# Altium project UVB LED Controller.PrjPcb
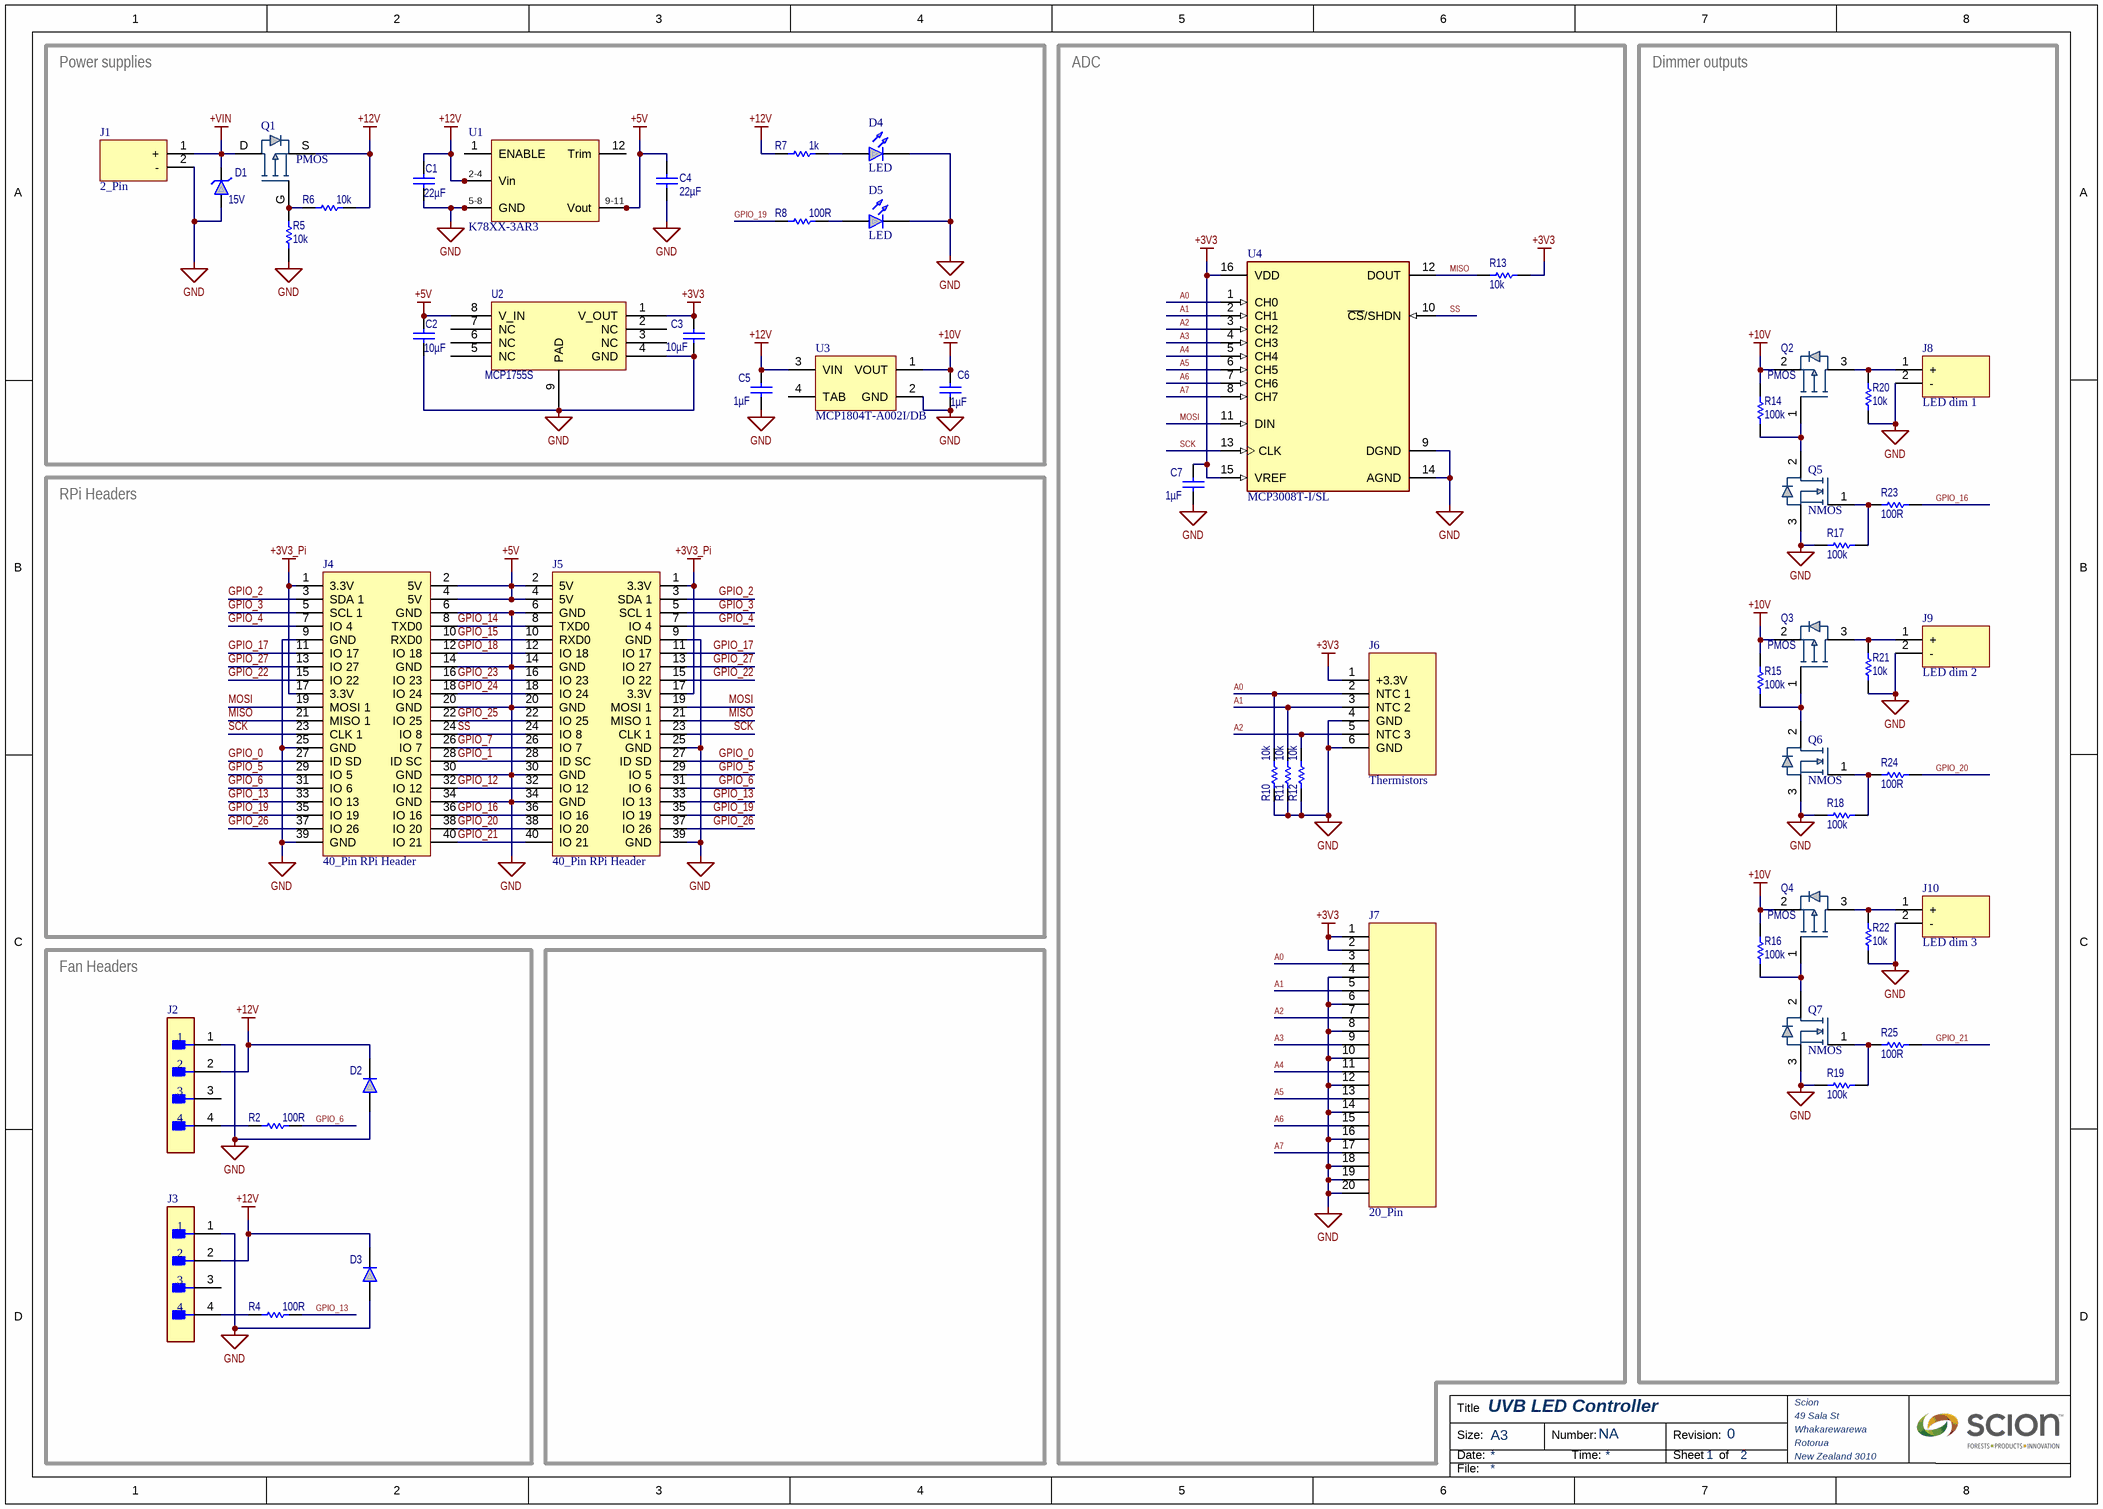
[diagram p0: UVB LED Controller.SchDoc]
2 sheets, 142 parts. Net scope: global (net labels, ports and power ports of the same name join across sheets).
Board file: UVB LED Controller.PcbDoc
Sheets:
  UVB LED Controller.SchDoc
  UVB LED Controller - current balancing.SchDoc

## Sheet UVB LED Controller.SchDoc: UVB LED Controller
size A3; Author: Peake J; CompanyName: Scion Research; DrawnBy: Peake J; Engineer: Peake J; Organization: Scion; Address1: 49 Sala St; Address2: Whakarewarewa; Address3: Rotorua; Address4: New Zealand 3010; DocumentNumber: NA; Revision: 0; SheetNumber: 1; SheetTotal: 2

### Parts
C1  value 22µF  [1206_CAP]  (hidden comment: Capacitor)
C2  value 10µF  [0603_CAP]  (hidden comment: Capacitor)
C3  value 10µF  [0603_CAP]  (hidden comment: Capacitor)
C4  value 22µF  [1206_CAP]  (hidden comment: Capacitor)
C5  value 1µF  [0603_CAP]  (hidden comment: Capacitor)
C6  value 1µF  [0603_CAP]  (hidden comment: Capacitor)
C7  value 1µF  [0603_CAP]  (hidden comment: Capacitor)
D1  Rated Voltage: 15V  [SMBJ]  (hidden comment: Transil)
D2  Diode  [SOD-123]  (value not drawn)
D3  Diode  [SOD-123]  (value not drawn)
D4  LED  [KPA-2106S_LED]
D5  LED  [KPA-2106S_LED]
J1  2_Pin  [2P 3.81mm Header Plugable]
J2  22-29-2041  [FP-22-29-2041-MFG]  (value not drawn)
J3  22-29-2041  [FP-22-29-2041-MFG]  (value not drawn)
J4  40_Pin RPi Header  [40_Pin_0.1in_male_header]
J5  40_Pin RPi Header  [40_Pin_0.1in_female_header]
J6  Thermistors  [6P RA MOLEX Clik-MATE 1.5mm]
J7  20_Pin  [20P 2.54mm DIP header]
J8  LED dim 1  [2P 3.81mm Header Plugable]
J9  LED dim 2  [2P 3.81mm Header Plugable]
J10  LED dim 3  [2P 3.81mm Header Plugable]
Q1  PMOS  [PowerDI 5060-8]
Q2  PMOS  [SOT-23-PMOS]
Q3  PMOS  [SOT-23-PMOS]
Q4  PMOS  [SOT-23-PMOS]
Q5  NMOS  [SOT-23]
Q6  NMOS  [SOT-23]
Q7  NMOS  [SOT-23]
R2  value 100R  [0603_RES]  (hidden comment: Resistor)
R4  value 100R  [0603_RES]  (hidden comment: Resistor)
R5  value 10k  [0603_RES]  (hidden comment: Resistor)
R6  value 10k  [0603_RES]  (hidden comment: Resistor)
R7  value 1k  [0603_RES]  (hidden comment: Resistor)
R8  value 100R  [0603_RES]  (hidden comment: Resistor)
R10  value 10k  [0603_RES]  (hidden comment: Resistor)
R11  value 10k  [0603_RES]  (hidden comment: Resistor)
R12  value 10k  [0603_RES]  (hidden comment: Resistor)
R13  value 10k  [0603_RES]  (hidden comment: Resistor)
R14  value 100k  [0603_RES]  (hidden comment: Resistor)
R15  value 100k  [0603_RES]  (hidden comment: Resistor)
R16  value 100k  [0603_RES]  (hidden comment: Resistor)
R17  value 100k  [0603_RES]  (hidden comment: Resistor)
R18  value 100k  [0603_RES]  (hidden comment: Resistor)
R19  value 100k  [0603_RES]  (hidden comment: Resistor)
R20  value 10k  [0603_RES]  (hidden comment: Resistor)
R21  value 10k  [0603_RES]  (hidden comment: Resistor)
R22  value 10k  [0603_RES]  (hidden comment: Resistor)
R23  value 100R  [0603_RES]  (hidden comment: Resistor)
R24  value 100R  [0603_RES]  (hidden comment: Resistor)
R25  value 100R  [0603_RES]  (hidden comment: Resistor)
U1  K78XX-3AR3  [K78XX-3AR3-Footprint]
U2  MCP1755S  [8P 2x3 DFN]
U3  MCP1804T-A002I/DB  [SOT-223-DB3_N]
U4  MCP3008T-I/SL  [FP-C04-108-MFG]

### Blocks framed on the sheet
Power supplies: C1-C6 D1 D4 D5 J1 Q1 R5-R8 U1-U3
ADC: C7 J6 J7 R10-R13 U4
Dimmer outputs: J8-J10 Q2-Q7 R14-R25
RPi Headers: J4 J5
Fan Headers: D2 D3 J2 J3 R2 R4

### Nets
+3V3: C3.1 C7.1 J6.1(+3.3V) J7.1 J7.2 R13.1 U2.1(V_OUT) U4.15(VREF) U4.16(VDD)
+3V3_Pi: J4.1(3.3V) J4.17(3.3V) J5.1(3.3V) J5.17(3.3V)
+5V: C2.1 C4.2 J4.2(5V) J4.4(5V) J5.2(5V) J5.4(5V) U1.9(Vout) U1.10(Vout) U1.11(Vout) U2.8(V_IN)
+10V: C6.1 Q2.2(S) Q3.2(S) Q4.2(S) R14.2 R15.2 R16.2 U3.1(VOUT)
+12V: C1.1 C5.1 D2.1(K) D3.1(K) J2.2 J3.2 Q1.S R6.2 R7.1 U1.2(Vin) U1.3(Vin) U1.4(Vin) U3.3(VIN)
+VIN: D1.2(K) J1.1(+) Q1.D
GND: C1.2 C2.2 C3.2 C4.1 C5.2 C6.2 C7.2 D1.1(A) D2.2(A) D3.2(A) D4.1(K) D5.1(K) J1.2(-) J2.1 J3.1 J4.6(GND) J4.9(GND) J4.14(GND) J4.20(GND) J4.25(GND) J4.30(GND) J4.34(GND) J4.39(GND) J5.6(GND) J5.9(GND) J5.14(GND) J5.20(GND) J5.25(GND) J5.30(GND) J5.34(GND) J5.39(GND) J6.4(GND) J6.6(GND) J7.4 J7.6 J7.8 J7.10 J7.12 J7.14 J7.16 J7.18 J7.19 J7.20 J8.2(-) J9.2(-) J10.2(-) Q5.3(S) Q6.3(S) Q7.3(S) R5.1 R10.1 R11.1 R12.1 R17.2 R18.2 R19.2 R20.1 R21.1 R22.1 U1.5(GND) U1.6(GND) U1.7(GND) U1.8(GND) U2.4(GND) U2.9(PAD) U3.2(GND) U4.9(DGND) U4.14(AGND)
A0: J6.2(NTC_1) J7.3 R10.2 U4.1(CH0)
A1: J6.3(NTC_2) J7.5 R11.2 U4.2(CH1)
A2: J6.5(NTC_3) J7.7 R12.2 U4.3(CH2)
A3: J7.9 U4.4(CH3)
A4: J7.11 U4.5(CH4)
A5: J7.13 U4.6(CH5)
A6: J7.15 U4.7(CH6)
A7: J7.17 U4.8(CH7)
GPIO_0: J4.27(ID_SD) J5.27(ID_SD)
GPIO_1: J4.28(ID_SC) J5.28(ID_SC)
GPIO_2: J4.3(SDA_1) J5.3(SDA_1)
GPIO_3: J4.5(SCL_1) J5.5(SCL_1)
GPIO_4: J4.7(IO_4) J5.7(IO_4)
GPIO_5: J4.29(IO_5) J5.29(IO_5)
GPIO_6: J4.31(IO_6) J5.31(IO_6) R2.2
GPIO_7: J4.26(IO_7) J5.26(IO_7)
GPIO_12: J4.32(IO_12) J5.32(IO_12)
GPIO_13: J4.33(IO_13) J5.33(IO_13) R4.2
GPIO_14: J4.8(TXD0) J5.8(TXD0)
GPIO_15: J4.10(RXD0) J5.10(RXD0)
GPIO_16: J4.36(IO_16) J5.36(IO_16) R23.1
GPIO_17: J4.11(IO_17) J5.11(IO_17)
GPIO_18: J4.12(IO_18) J5.12(IO_18)
GPIO_19: J4.35(IO_19) J5.35(IO_19) R8.1
GPIO_20: J4.38(IO_20) J5.38(IO_20) R24.1
GPIO_21: J4.40(IO_21) J5.40(IO_21) R25.1
GPIO_22: J4.15(IO_22) J5.15(IO_22)
GPIO_23: J4.16(IO_23) J5.16(IO_23)
GPIO_24: J4.18(IO_24) J5.18(IO_24)
GPIO_25: J4.22(IO_25) J5.22(IO_25)
GPIO_26: J4.37(IO_26) J5.37(IO_26)
GPIO_27: J4.13(IO_27) J5.13(IO_27)
MISO: J4.21(MISO_1) J5.21(MISO_1) R13.2 U4.12(DOUT)
MOSI: J4.19(MOSI_1) J5.19(MOSI_1) U4.11(DIN)
SCK: J4.23(CLK_1) J5.23(CLK_1) U4.13(CLK)
SS: J4.24(IO_8) J5.24(IO_8) U4.10(~{CS}/SHDN)
NetD4_2: D4.2(A) R7.2
NetD5_2: D5.2(A) R8.2
NetJ2_4: J2.4 R2.1
NetJ3_4: J3.4 R4.1
NetJ8_1: J8.1(+) Q2.3(D) R20.2
NetJ9_1: J9.1(+) Q3.3(D) R21.2
NetJ10_1: J10.1(+) Q4.3(D) R22.2
NetQ1_G: Q1.G R5.2 R6.1
NetQ2_1: Q2.1(G) Q5.2(D) R14.1
NetQ3_1: Q3.1(G) Q6.2(D) R15.1
NetQ4_1: Q4.1(G) Q7.2(D) R16.1
NetQ5_1: Q5.1(G) R17.1 R23.2
NetQ6_1: Q6.1(G) R18.1 R24.2
NetQ7_1: Q7.1(G) R19.1 R25.2

Not connected (* = marked no-connect by the designer): J2 3; J3 3; U1 1(ENABLE) 12(Trim); U2 2(NC) 3(NC) 5(NC) 6(NC) 7(NC); U3 4(TAB)

### Notes on the sheet
- Title
- Size:
- Date:
- A3
- Number:
- Time:
- Revision:
- Sheet
- of
- File:
- (in symbol CMP-015-000000-2) 2-4; 5-8; 9-11

### Library data of the parts
C1-C7 = CMP-001-00172-2: SMD Capacitor; Pins: 2; Source: Discrete.SchLib; Design Item ID: Capacitor; Component Type: Standard
D1 = CMP-079-000108-2: Transient Voltage Suppressor; MFN: SMBJ33A; Component Type: Standard; Pin Count: 2; Source: Discrete.SchLib; Breakdown Voltage: *; Design Item ID: Transil; Clamping Voltage: *
D2 D3 = CMP-004-00083-4: SMD Diode; Design Item ID: Diode; Pins: 2; Source: Discrete.SchLib; Component Type: Standard; Pin Count: 2
D4 D5 = CMP-004-00084-2: SMD LED; Colour: RED; Source: Discrete.SchLib; Design Item ID: LED; Component Type: Standard; Pin Count: 2; Pins: 2
J1 J8-J10 = CMP-002-00173-1: 2 Pin Connector; Design Item ID: 2_Pin; Pins: 2; Pin Count: 2; MFN: *; Component Type: Standard; Source: Connectors.SchLib
J2 J3 = CMP-04776-000366-1: CONN HEADER VERT 4POS 2.54MM; Insulation Resistance: 50GR; Voltage Rating: 250V; Glow Wire Compliant: Non-compliant; Max Current Rating: 4A; Number of Circuits: 4; Contact Resistance: 10mR; Gender: Male; Number of Lines: 1; Length: 10.16mm; Radiation Hardening: No; Pitch: 2.54mm; Contact Material: Brass; Height: 11.7mm; Max Operating Temperature: 75°C; Flammability Rating: UL94 V-0; Mount: Through Hole; Voltage Rating (DC): 250V; Halogen Free: Low Halogen; Housing Color: White; Package Quantity: 1500; Series: KK® 6410; Number of Rows: 1; Housing Material: Nylon; Depth: 5.8mm; RoHS Compliant: Yes; Orientation: Straight; Contact Gender: Male; Color: Natural; Current Rating: 4A; Contact Mating Length: 0.295inch; Number of Poles: 4; Packaging: Bulk; Contact Type: Male Pin; Termination: Solder; Number of Positions: 4; Number of Contacts: 4; Lead Free: Lead Free; Min Operating Temperature: 0°C; Fastening Type: Friction; Contact Plating: Gold
J4 J5 = CMP-002-00133-3: 40 pin header for Raspberry Pi compatible connections; Source: All Components - 30.06.23 - 18.27.SchLib; Component Type: Standard; Pin Count: 40; Design Item ID: CMP-00031-2
J6 = CMP-002-00180-3: 6 Pin Connector; Pins: 6; Component Type: Standard; Pin Count: 6; Design Item ID: 6_Pin; Source: Connectors.SchLib
J7 = CMP-002-00001-3: 20 pin connector
Q1 = CMP-079-000102-2: P Channel MOSFET; MFN: *; Design Item ID: PMOS GDS; VGS Max: *; Continuous Current: *; VDS Breakdown: *; Source: P-MOS.SchLib; Component Type: Standard; Pin Count: 3
Q2-Q4 = CMP-079-000100-1: P Channel MOSFET; MFN: BSS308PE; Source: P-MOS.SchLib; Component Type: Standard; Design Item ID: PMOS; Pin Count: 3
Q5-Q7 = CMP-079-000093-2: N Channel MOSFET; Design Item ID: NMOS; Source: N-MOS.SchLib; MFN: *; Pin Count: 3; Component Type: Standard
R2 R4-R8 R10-R25 = CMP-009-00356-1: SMD Resistor; Pins: 2; Source: Discrete.SchLib; Component Type: Standard; Design Item ID: Resistor
U1 = CMP-015-000000-2: Mornsun DC-DC power module 3A, 0-36Vin, 3.3-15V out
U2 = CMP-079-000090-2: LDO Linear Voltage Regulator; Pin Count: 9; Component Type: Standard; Source: Microchip.SchLib; Design Item ID: MCP1755S
U3 = CMP-0136-00501-1: 150 mA, 28V LDO Regulator With Shutdown, 3-Pin SOT-223, Industrial Temperature, Tape and Reel; PackageDescription: 3-Lead Plastic Small Outline Transistor (DB) [SOT-223]; PackageReference: SOT-223-DB3; DatasheetVersion: revB, Nov-2009; PackageVersion: revBB, Aug-2009
U4 = CMP-0188-00351-3: IC ADC 10BIT SAR 16SOIC; Resolution: 10b; Output Voltage: 4.1V; Number of Channels: 8; Number of Elements: 1; Number of Bits: 10; Full Scale Error: 1LSB; Signal to Noise Ratio (SNR): 200dB; Interface: SPI; Nominal Supply Current: 425uA; Sampling Rate: 200KS/s; Supply Type: Single; Min Supply Voltage: 2.7V; Max Supply Voltage: 5.5V; Operating Supply Voltage: 5V; Polarity: Unipolar; Min Operating Temperature: -40°C; REACH SVHC: No SVHC; Integral Nonlinearity (INL): 1LSB; Mount: Surface Mount; Number of Converters: 1; Differential Nonlinearity: 1LSB; Contact Plating: Tin; Lead Free: Lead Free; Conversion Rate: 200KS/s; Radiation Hardening: No; Max Operating Temperature: 85°C; Case/Package: SOIC; Package Quantity: 2600; Number of Pins: 16; Packaging: Tape and Reel; Number of A/D Converters: 1

## Sheet UVB LED Controller - current balancing.SchDoc: UVB LED Current Balancing
size A3; Author: Peake J; CompanyName: Scion Research; DrawnBy: Peake J; Engineer: Peake J; Organization: Scion; Address1: 49 Sala St; Address2: Whakarewarewa; Address3: Rotorua; Address4: New Zealand 3010; DocumentNumber: NA; Revision: 0; SheetNumber: 2; SheetTotal: 2
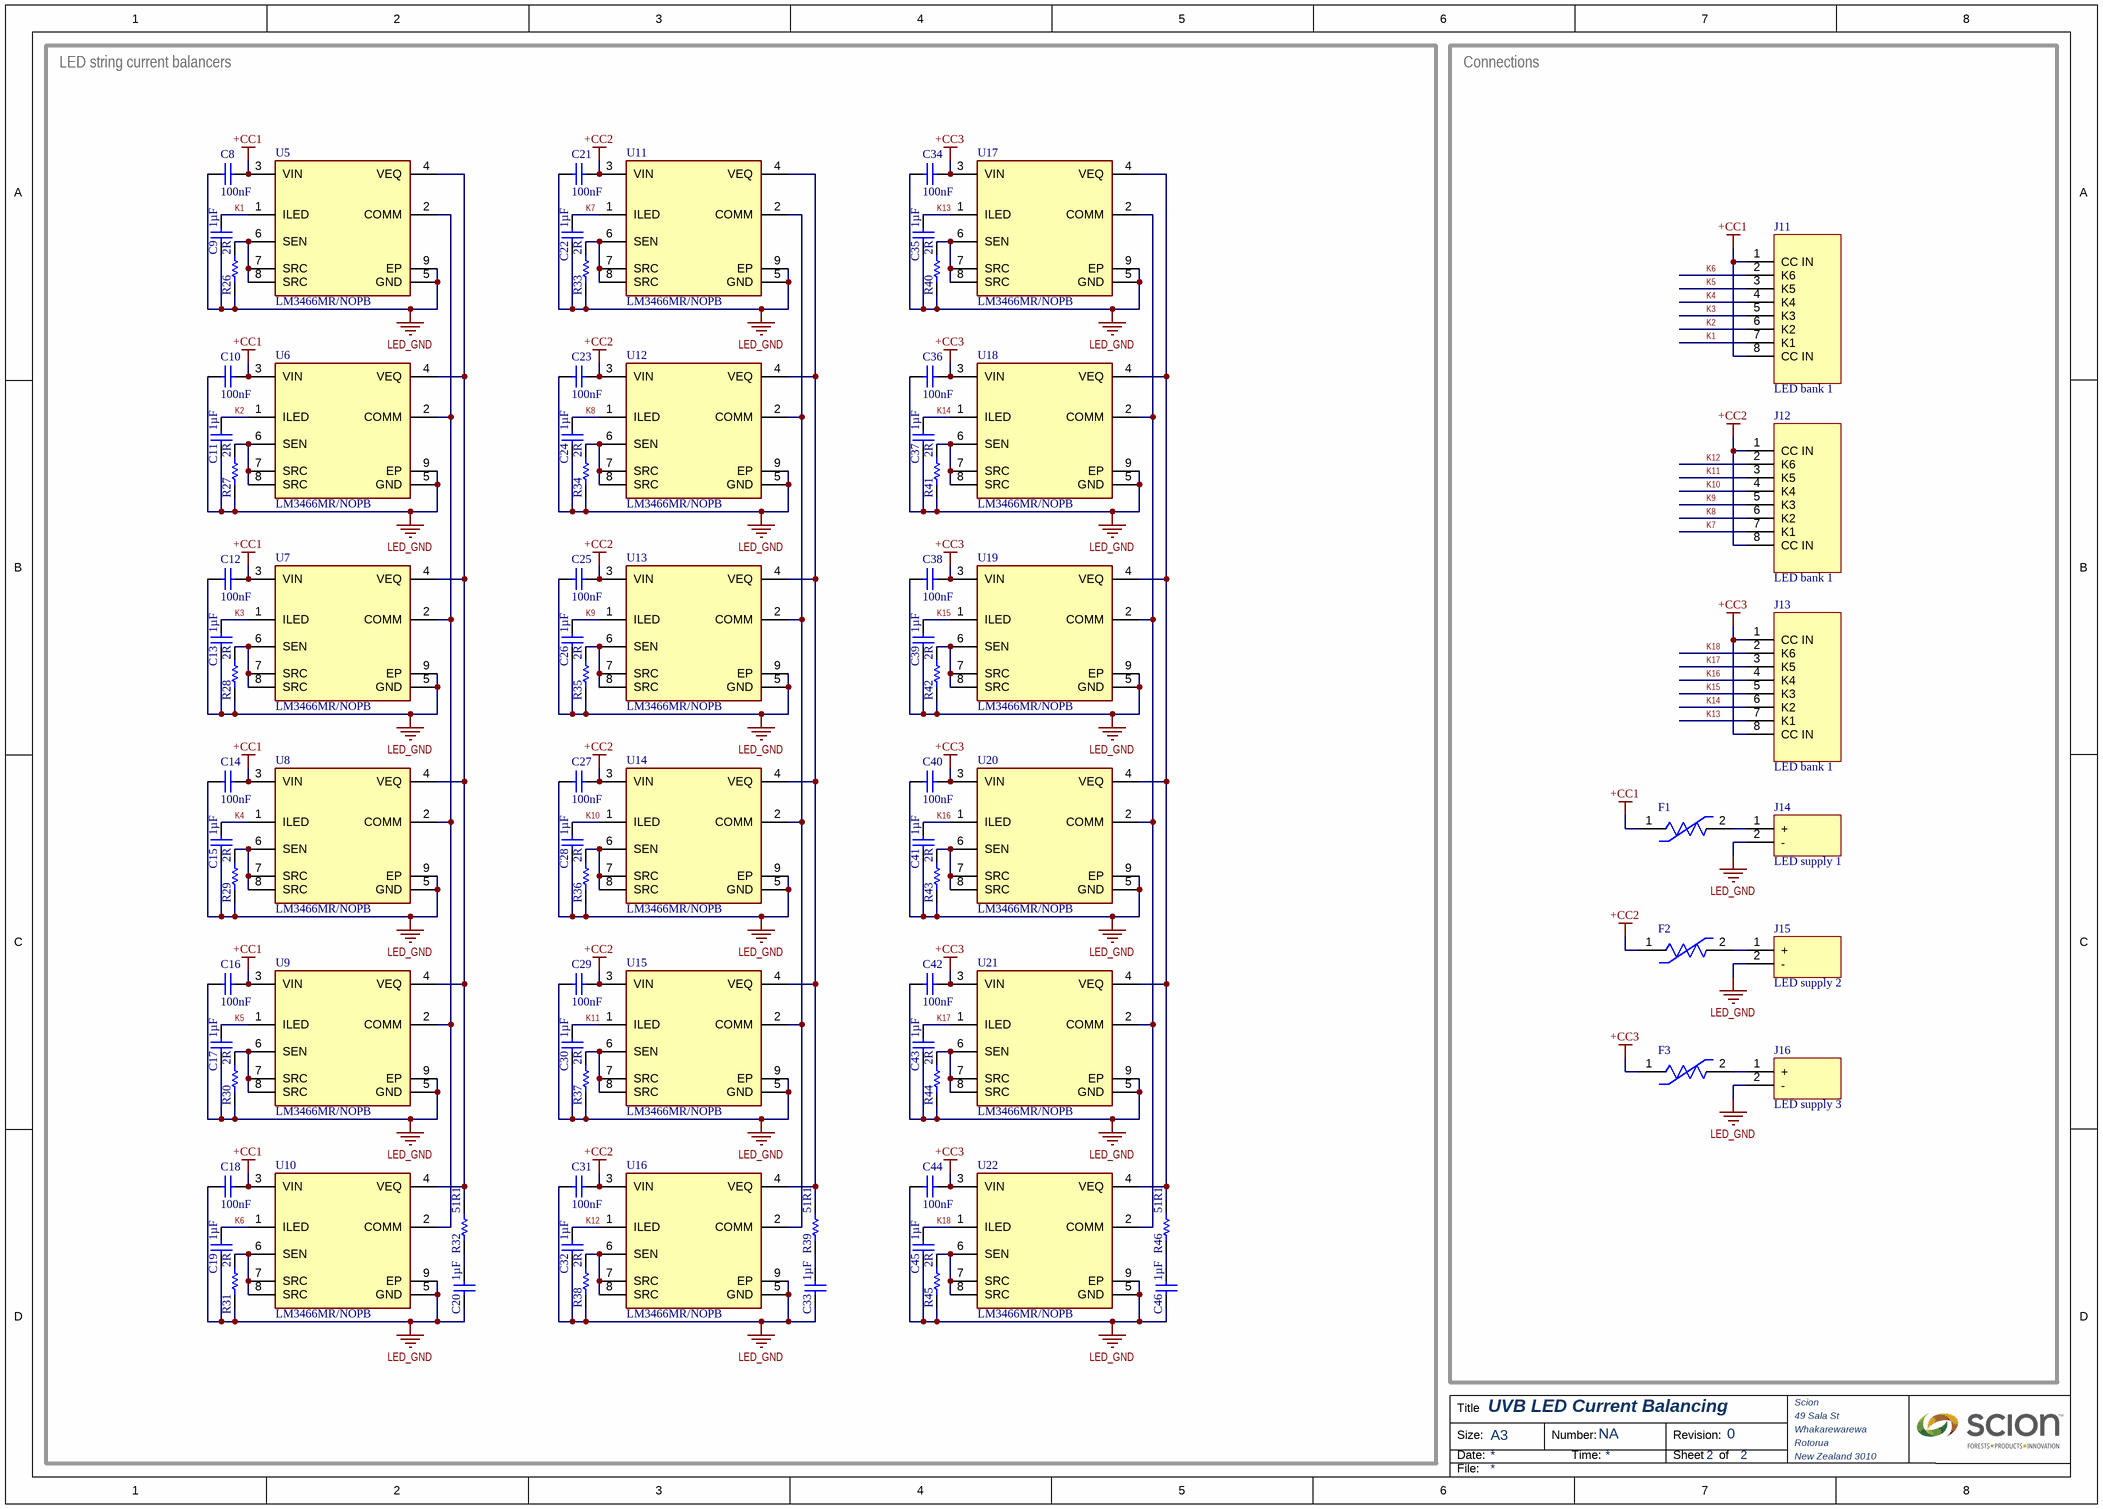
[diagram p1: UVB LED Controller - current balancing.SchDoc]

### Parts
C8  value 100nF  [0603_CAP]  (hidden comment: Capacitor)
C9  value 1µF  [0603_CAP]  (hidden comment: Capacitor)
C10  value 100nF  [0603_CAP]  (hidden comment: Capacitor)
C11  value 1µF  [0603_CAP]  (hidden comment: Capacitor)
C12  value 100nF  [0603_CAP]  (hidden comment: Capacitor)
C13  value 1µF  [0603_CAP]  (hidden comment: Capacitor)
C14  value 100nF  [0603_CAP]  (hidden comment: Capacitor)
C15  value 1µF  [0603_CAP]  (hidden comment: Capacitor)
C16  value 100nF  [0603_CAP]  (hidden comment: Capacitor)
C17  value 1µF  [0603_CAP]  (hidden comment: Capacitor)
C18  value 100nF  [0603_CAP]  (hidden comment: Capacitor)
C19  value 1µF  [0603_CAP]  (hidden comment: Capacitor)
C20  value 1µF  [0603_CAP]  (hidden comment: Capacitor)
C21  value 100nF  [0603_CAP]  (hidden comment: Capacitor)
C22  value 1µF  [0603_CAP]  (hidden comment: Capacitor)
C23  value 100nF  [0603_CAP]  (hidden comment: Capacitor)
C24  value 1µF  [0603_CAP]  (hidden comment: Capacitor)
C25  value 100nF  [0603_CAP]  (hidden comment: Capacitor)
C26  value 1µF  [0603_CAP]  (hidden comment: Capacitor)
C27  value 100nF  [0603_CAP]  (hidden comment: Capacitor)
C28  value 1µF  [0603_CAP]  (hidden comment: Capacitor)
C29  value 100nF  [0603_CAP]  (hidden comment: Capacitor)
C30  value 1µF  [0603_CAP]  (hidden comment: Capacitor)
C31  value 100nF  [0603_CAP]  (hidden comment: Capacitor)
C32  value 1µF  [0603_CAP]  (hidden comment: Capacitor)
C33  value 1µF  [0603_CAP]  (hidden comment: Capacitor)
C34  value 100nF  [0603_CAP]  (hidden comment: Capacitor)
C35  value 1µF  [0603_CAP]  (hidden comment: Capacitor)
C36  value 100nF  [0603_CAP]  (hidden comment: Capacitor)
C37  value 1µF  [0603_CAP]  (hidden comment: Capacitor)
C38  value 100nF  [0603_CAP]  (hidden comment: Capacitor)
C39  value 1µF  [0603_CAP]  (hidden comment: Capacitor)
C40  value 100nF  [0603_CAP]  (hidden comment: Capacitor)
C41  value 1µF  [0603_CAP]  (hidden comment: Capacitor)
C42  value 100nF  [0603_CAP]  (hidden comment: Capacitor)
C43  value 1µF  [0603_CAP]  (hidden comment: Capacitor)
C44  value 100nF  [0603_CAP]  (hidden comment: Capacitor)
C45  value 1µF  [0603_CAP]  (hidden comment: Capacitor)
C46  value 1µF  [0603_CAP]  (hidden comment: Capacitor)
F1  0ZCF0100AF2A  [FP-0ZCF0100AF2A-MFG]  (value not drawn)
F2  0ZCF0100AF2A  [FP-0ZCF0100AF2A-MFG]  (value not drawn)
F3  0ZCF0100AF2A  [FP-0ZCF0100AF2A-MFG]  (value not drawn)
J11  LED bank 1  [8P RA MOLEX Clik-MATE 1.5mm]
J12  LED bank 1  [8P RA MOLEX Clik-MATE 1.5mm]
J13  LED bank 1  [8P RA MOLEX Clik-MATE 1.5mm]
J14  LED supply 1  [2P 3.81mm Header Plugable]
J15  LED supply 2  [2P 3.81mm Header Plugable]
J16  LED supply 3  [2P 3.81mm Header Plugable]
R26  value 2R  [0603_RES]  (hidden comment: Resistor)
R27  value 2R  [0603_RES]  (hidden comment: Resistor)
R28  value 2R  [0603_RES]  (hidden comment: Resistor)
R29  value 2R  [0603_RES]  (hidden comment: Resistor)
R30  value 2R  [0603_RES]  (hidden comment: Resistor)
R31  value 2R  [0603_RES]  (hidden comment: Resistor)
R32  value 51R1  [0603_RES]  (hidden comment: Resistor)
R33  value 2R  [0603_RES]  (hidden comment: Resistor)
R34  value 2R  [0603_RES]  (hidden comment: Resistor)
R35  value 2R  [0603_RES]  (hidden comment: Resistor)
R36  value 2R  [0603_RES]  (hidden comment: Resistor)
R37  value 2R  [0603_RES]  (hidden comment: Resistor)
R38  value 2R  [0603_RES]  (hidden comment: Resistor)
R39  value 51R1  [0603_RES]  (hidden comment: Resistor)
R40  value 2R  [0603_RES]  (hidden comment: Resistor)
R41  value 2R  [0603_RES]  (hidden comment: Resistor)
R42  value 2R  [0603_RES]  (hidden comment: Resistor)
R43  value 2R  [0603_RES]  (hidden comment: Resistor)
R44  value 2R  [0603_RES]  (hidden comment: Resistor)
R45  value 2R  [0603_RES]  (hidden comment: Resistor)
R46  value 51R1  [0603_RES]  (hidden comment: Resistor)
U5  LM3466MR/NOPB  [FP-DDA0008A-MFG]
U6  LM3466MR/NOPB  [FP-DDA0008A-MFG]
U7  LM3466MR/NOPB  [FP-DDA0008A-MFG]
U8  LM3466MR/NOPB  [FP-DDA0008A-MFG]
U9  LM3466MR/NOPB  [FP-DDA0008A-MFG]
U10  LM3466MR/NOPB  [FP-DDA0008A-MFG]
U11  LM3466MR/NOPB  [FP-DDA0008A-MFG]
U12  LM3466MR/NOPB  [FP-DDA0008A-MFG]
U13  LM3466MR/NOPB  [FP-DDA0008A-MFG]
U14  LM3466MR/NOPB  [FP-DDA0008A-MFG]
U15  LM3466MR/NOPB  [FP-DDA0008A-MFG]
U16  LM3466MR/NOPB  [FP-DDA0008A-MFG]
U17  LM3466MR/NOPB  [FP-DDA0008A-MFG]
U18  LM3466MR/NOPB  [FP-DDA0008A-MFG]
U19  LM3466MR/NOPB  [FP-DDA0008A-MFG]
U20  LM3466MR/NOPB  [FP-DDA0008A-MFG]
U21  LM3466MR/NOPB  [FP-DDA0008A-MFG]
U22  LM3466MR/NOPB  [FP-DDA0008A-MFG]

### Blocks framed on the sheet
LED string current balancers: C8-C46 R26-R46 U5-U22
Connections: F1-F3 J11-J16

### Nets
+CC1: C8.1 C10.1 C12.1 C14.1 C16.1 C18.1 F1.1 J11.1(CC_IN) J11.8(CC_IN) U5.3(VIN) U6.3(VIN) U7.3(VIN) U8.3(VIN) U9.3(VIN) U10.3(VIN)
+CC2: C21.1 C23.1 C25.1 C27.1 C29.1 C31.1 F2.1 J12.1(CC_IN) J12.8(CC_IN) U11.3(VIN) U12.3(VIN) U13.3(VIN) U14.3(VIN) U15.3(VIN) U16.3(VIN)
+CC3: C34.1 C36.1 C38.1 C40.1 C42.1 C44.1 F3.1 J13.1(CC_IN) J13.8(CC_IN) U17.3(VIN) U18.3(VIN) U19.3(VIN) U20.3(VIN) U21.3(VIN) U22.3(VIN)
LED_GND: C8.2 C9.2 C10.2 C11.2 C12.2 C13.2 C14.2 C15.2 C16.2 C17.2 C18.2 C19.2 C20.1 C21.2 C22.2 C23.2 C24.2 C25.2 C26.2 C27.2 C28.2 C29.2 C30.2 C31.2 C32.2 C33.1 C34.2 C35.2 C36.2 C37.2 C38.2 C39.2 C40.2 C41.2 C42.2 C43.2 C44.2 C45.2 C46.1 J14.2(-) J15.2(-) J16.2(-) R26.1 R27.1 R28.1 R29.1 R30.1 R31.1 R33.1 R34.1 R35.1 R36.1 R37.1 R38.1 R40.1 R41.1 R42.1 R43.1 R44.1 R45.1 U5.5(GND) U5.9(EP) U6.5(GND) U6.9(EP) U7.5(GND) U7.9(EP) U8.5(GND) U8.9(EP) U9.5(GND) U9.9(EP) U10.5(GND) U10.9(EP) U11.5(GND) U11.9(EP) U12.5(GND) U12.9(EP) U13.5(GND) U13.9(EP) U14.5(GND) U14.9(EP) U15.5(GND) U15.9(EP) U16.5(GND) U16.9(EP) U17.5(GND) U17.9(EP) U18.5(GND) U18.9(EP) U19.5(GND) U19.9(EP) U20.5(GND) U20.9(EP) U21.5(GND) U21.9(EP) U22.5(GND) U22.9(EP)
K1: C9.1 J11.7(K1) U5.1(ILED)
K2: C11.1 J11.6(K2) U6.1(ILED)
K3: C13.1 J11.5(K3) U7.1(ILED)
K4: C15.1 J11.4(K4) U8.1(ILED)
K5: C17.1 J11.3(K5) U9.1(ILED)
K6: C19.1 J11.2(K6) U10.1(ILED)
K7: C22.1 J12.7(K1) U11.1(ILED)
K8: C24.1 J12.6(K2) U12.1(ILED)
K9: C26.1 J12.5(K3) U13.1(ILED)
K10: C28.1 J12.4(K4) U14.1(ILED)
K11: C30.1 J12.3(K5) U15.1(ILED)
K12: C32.1 J12.2(K6) U16.1(ILED)
K13: C35.1 J13.7(K1) U17.1(ILED)
K14: C37.1 J13.6(K2) U18.1(ILED)
K15: C39.1 J13.5(K3) U19.1(ILED)
K16: C41.1 J13.4(K4) U20.1(ILED)
K17: C43.1 J13.3(K5) U21.1(ILED)
K18: C45.1 J13.2(K6) U22.1(ILED)
NetC20_2: C20.2 R32.1
NetC33_2: C33.2 R39.1
NetC46_2: C46.2 R46.1
NetF1_2: F1.2 J14.1(+)
NetF2_2: F2.2 J15.1(+)
NetF3_2: F3.2 J16.1(+)
NetR26_2: R26.2 U5.6(SEN) U5.7(SRC) U5.8(SRC)
NetR27_2: R27.2 U6.6(SEN) U6.7(SRC) U6.8(SRC)
NetR28_2: R28.2 U7.6(SEN) U7.7(SRC) U7.8(SRC)
NetR29_2: R29.2 U8.6(SEN) U8.7(SRC) U8.8(SRC)
NetR30_2: R30.2 U9.6(SEN) U9.7(SRC) U9.8(SRC)
NetR31_2: R31.2 U10.6(SEN) U10.7(SRC) U10.8(SRC)
NetR32_2: R32.2 U5.4(VEQ) U6.4(VEQ) U7.4(VEQ) U8.4(VEQ) U9.4(VEQ) U10.4(VEQ)
NetR33_2: R33.2 U11.6(SEN) U11.7(SRC) U11.8(SRC)
NetR34_2: R34.2 U12.6(SEN) U12.7(SRC) U12.8(SRC)
NetR35_2: R35.2 U13.6(SEN) U13.7(SRC) U13.8(SRC)
NetR36_2: R36.2 U14.6(SEN) U14.7(SRC) U14.8(SRC)
NetR37_2: R37.2 U15.6(SEN) U15.7(SRC) U15.8(SRC)
NetR38_2: R38.2 U16.6(SEN) U16.7(SRC) U16.8(SRC)
NetR39_2: R39.2 U11.4(VEQ) U12.4(VEQ) U13.4(VEQ) U14.4(VEQ) U15.4(VEQ) U16.4(VEQ)
NetR40_2: R40.2 U17.6(SEN) U17.7(SRC) U17.8(SRC)
NetR41_2: R41.2 U18.6(SEN) U18.7(SRC) U18.8(SRC)
NetR42_2: R42.2 U19.6(SEN) U19.7(SRC) U19.8(SRC)
NetR43_2: R43.2 U20.6(SEN) U20.7(SRC) U20.8(SRC)
NetR44_2: R44.2 U21.6(SEN) U21.7(SRC) U21.8(SRC)
NetR45_2: R45.2 U22.6(SEN) U22.7(SRC) U22.8(SRC)
NetR46_2: R46.2 U17.4(VEQ) U18.4(VEQ) U19.4(VEQ) U20.4(VEQ) U21.4(VEQ) U22.4(VEQ)
NetU5_2: U5.2(COMM) U6.2(COMM) U7.2(COMM) U8.2(COMM) U9.2(COMM) U10.2(COMM)
NetU11_2: U11.2(COMM) U12.2(COMM) U13.2(COMM) U14.2(COMM) U15.2(COMM) U16.2(COMM)
NetU17_2: U17.2(COMM) U18.2(COMM) U19.2(COMM) U20.2(COMM) U21.2(COMM) U22.2(COMM)

### Notes on the sheet
- Title
- Size:
- Date:
- A3
- Number:
- Time:
- Revision:
- Sheet
- of
- File:

### Library data of the parts
C8-C46 = CMP-001-00172-2: SMD Capacitor; Pins: 2; Source: Discrete.SchLib; Design Item ID: Capacitor; Component Type: Standard
F1-F3 = CMP-005-00014-2: PTC Resettable Fuse 100A 0.5s 60VDC 0.09 Ohm 2-Pin 2920 T/R; Time to Trip: 500ms; Hold Current: 1A; Trip Current: 2A; Pins: 2; Component Type: Standard; Thickness: 0.067inch; Width: 0.202inch; Series: 0ZCF; Max Operating Temperature: 85°C; Source: All Components - 30.06.23 - 18.27.SchLib; Min Operating Temperature: -40°C; Design Item ID: CMP-00051-1; Length: 0.29inch; Case/Package: 2920; RoHS Compliant: Yes; Packaging: Cut Tape; Max Current Rating: 100A; Case Code (Metric): 7351; Mount: Surface Mount
J11-J13 = CMP-002-00183-2: 8 Pin Connector; Pin Count: 8; Design Item ID: 8_Pin; Component Type: Standard; Pins: 8; Source: Connectors.SchLib
J14-J16 = CMP-002-00173-1: 2 Pin Connector; Design Item ID: 2_Pin; Pins: 2; Pin Count: 2; MFN: *; Component Type: Standard; Source: Connectors.SchLib
R26-R46 = CMP-009-00356-3: SMD Resistor; Pins: 2; Component Type: Standard; Design Item ID: Resistor; Source: Discrete.SchLib
U5-U22 = CMP-04914-000005-1: IC LED DRIVER LIN 1.5A 8SOPWRPAD; Manufacturer: Texas Instruments; Min Supply Voltage: 6V; Max Junction Temp: +125°C; Max Supply Voltage: 70V; Dimming: Analog; Standoff Height: 0mm; Number Of Outputs: 1; Nominal Supply Current: 550uA; Ipc Land Pattern Name: SOIC127P600X170-8; Output Current: 1.5A; Temperature Range Low: -40°C; Octopart: https://octopart.com/lm3466mr%2Fnopb-texas+instruments-24813886; Category: IC; ComponentLink2URL: http://www.ti.com/lit/ds/symlink/lm3466.pdf; Automotive: No; Device Class L2: Power Management ICs; Package: DDA0008A; Device Class L1: Integrated Circuits (ICs); Mouser Description: Multi-String LED Current Balancer for Use with Constant Current Power Supplies 8-SO PowerPAD -40 to 125; Output Voltage: 70V; Lead Free: Yes; Digikey Description: IC LED DRIVER LIN 1.5A 8SOPWRPAD; Temperature: -40°C to +125°C; Temperature Range High: +125°C; Height: 1.7mm; Device Class L3: LED Drivers; Manufacturer Part Number: LM3466MR/NOPB; RoHS: TRUE; ComponentLink2Description: Datasheet